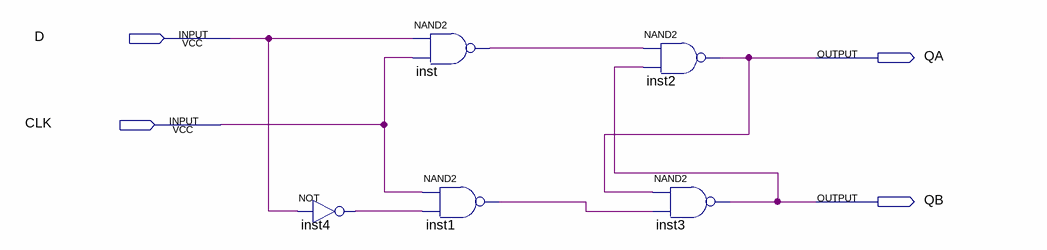
[diagram p0: schematic sheet]
// Quartus schematic latch2.bdf as structural Verilog: 5 symbols, 4 pins
module latch2 (
  input  D,
  input  CLK,
  output QA,
  output QB
);

  wire inst1_out, inst4_out, inst_out;

  not inst4 (inst4_out, D);
  nand inst (inst_out, D, CLK);
  nand inst1 (inst1_out, CLK, inst4_out);
  nand inst2 (QA, inst_out, QB);
  nand inst3 (QB, QA, inst1_out);
endmodule
